# Altium project Integrated Preamp.PrjPcb
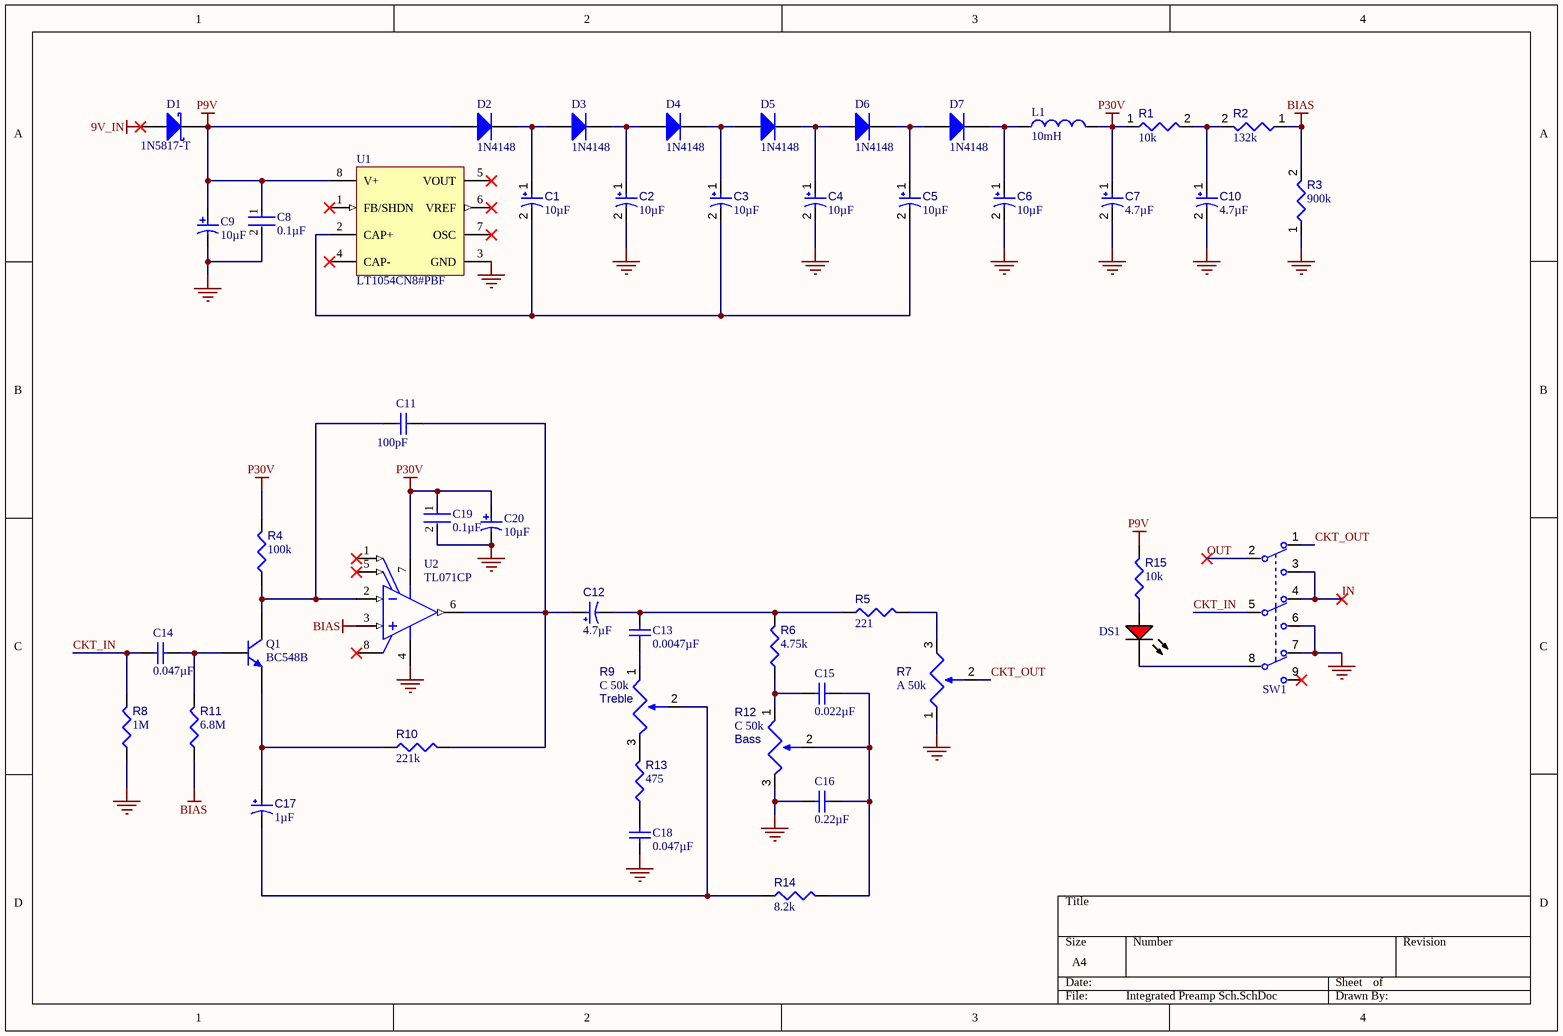
[diagram p0: Integrated Preamp Sch.SchDoc]
1 sheet, 48 parts. Net scope: global (net labels, ports and power ports of the same name join across sheets).
Board files: Integrated Preamp PCB v3.PcbDoc, Integrated Preamp PCB v2.PcbDoc

## Sheet Integrated Preamp Sch.SchDoc
size A4; SheetNumber: 1; SheetTotal: 1

### Parts
C1  value 10µF  [CAPPR55-200-1100X500X1200]  (hidden comment: ECA1HM100)
C2  value 10µF  [CAPPR55-200-1100X500X1200]  (hidden comment: ECA1HM100)
C3  value 10µF  [CAPPR55-200-1100X500X1200]  (hidden comment: ECA1HM100)
C4  value 10µF  [CAPPR55-200-1100X500X1200]  (hidden comment: ECA1HM100)
C5  value 10µF  [CAPPR55-200-1100X500X1200]  (hidden comment: ECA1HM100)
C6  value 10µF  [CAPPR55-200-1100X500X1200]  (hidden comment: ECA1HM100)
C7  value 4.7µF  [CAPPR55-200-1100X500X1200]  (hidden comment: ECA1HM4R7)
C8  0.1µF  [FP-C322C104K5R5TA-MFG]
C9  10µF  [AVX-TAP475K016SCS]
C10  value 4.7µF  [CAPPR55-200-1100X500X1200]  (hidden comment: ECA1HM4R7)
C11  Capacitance: 100pF  [WIMA-MKS2D034701E00]  (hidden comment: MKS2D034701E00KSSD)
C12  value 4.7µF  [CAPPR55-200-1100X500X1200]  (hidden comment: ECA1HM4R7)
C13  Capacitance: 0.0047µF  [WIMA-MKS2D024701A00KSSD]  (hidden comment: CMP-2000-06717-1)
C14  Capacitance: 0.047µF  [WIMA-MKS2D024701A00KSSD]  (hidden comment: .047µF)
C15  Capacitance: 0.022µF  [WIMA-MKS2D024701A00KSSD]  (hidden comment: CMP-2000-06717-1)
C16  Capacitance: 0.22µF  [WIMA-MKS2D024701A00KSSD]  (hidden comment: CMP-2000-06717-1)
C17  value 1µF  [CAPPR55-200-1100X500X1200]  (hidden comment: ECA-1HHG010)
C18  Capacitance: 0.047µF  [WIMA-MKS2D024701A00KSSD]  (hidden comment: CMP-2000-06717-1)
C19  0.1µF  [FP-C322C104K5R5TA-MFG]
C20  10µF  [AVX-TAP475K016SCS]
D1  1N5817-T  [DIOD-DO-41-P-2]
D2  1N4148  [NXP-SOD27-2_V]
D3  1N4148  [NXP-SOD27-2_V]
D4  1N4148  [NXP-SOD27-2_V]
D5  1N4148  [NXP-SOD27-2_V]
D6  1N4148  [NXP-SOD27-2_V]
D7  1N4148  [NXP-SOD27-2_V]
DS1  LTL-1CHE  [INDPR60-254-520X380X650]  (value not drawn)
L1  10mH  [EPCS-B78108S-2_V1]
Q1  BC548B  [ONSC-TO-92-3-29-11]
R1  value 10k  [RESA60-630X240]  (hidden comment: MFR-25FBF52-10K)
R2  value 132k  [RESA60-630X240]  (hidden comment: MFR-25FBF52-100K)
R3  value 900k  [RESA60-630X240]  (hidden comment: MFR-25FBF52-1M)
R4  value 100k  [RESA60-630X240]  (hidden comment: MFR-25FBF52-100K)
R5  value 221  [RESA60-630X240]  (hidden comment: MFR-25FBF52-221R)
R6  value 4.75k  [RESA60-630X240]  (hidden comment: MFR-25FBF52-4K75)
R7  value A 50k  [PCB Mount Potentiometer]  (hidden comment: Potentiometer)
R8  value 1M  [RESA60-630X240]  (hidden comment: MFR-25FBF52-4K75)
R9  Treble  value C 50k  [PCB Mount Potentiometer]
R10  value 221k  [RESA60-630X240]  (hidden comment: MFR-25FBF52-221K)
R11  value 6.8M  [RESA60-630X240]  (hidden comment: MFR-25FBF52-6.8M)
R12  Bass  value C 50k  [PCB Mount Potentiometer]
R13  value 475  [RESA60-630X240]  (hidden comment: MFR-25FBF52-475R)
R14  value 8.2k  [RESA60-630X240]  (hidden comment: MFR-25FBF52-4K75)
R15  value 10k  [RESA60-630X240]  (hidden comment: MFR-25FBF52-10K)
SW1  MPG306F  [3PDT Stomp]  (value not drawn)  (mechanical)
U1  LT1054CN8#PBF  [LT-N8-8]
U2  TL071CP  [P0008A]

### Nets
9V_IN: D1.1(A)
BIAS: R2.1 R3.2 R11.1 U2.3(IN+)
GND: C2.2 C4.2 C6.2 C7.2 C8.2 C9.2 C10.2 C16.1 C18.1 C19.2 C20.2 R3.1 R7.1 R8.1 R12.3 SW1.6 SW1.7 U1.3(GND) U2.4(VCC-)
P9V: C8.1 C9.1 D1.2(K) D2.1(A) R15.2 U1.8(V+)
P30V: C7.1 C19.1 C20.1 L1.2 R1.1 R4.2 U2.7(VCC+)
CKT_IN: C14.1 R8.2 SW1.5
CKT_OUT: R7.2 SW1.1
IN: SW1.3 SW1.4
OUT: SW1.2
NetC1_1: C1.1 D2.2(K) D3.1(A)
NetC1_2: C1.2 C3.2 C5.2 U1.2(CAP+)
NetC2_1: C2.1 D3.2(K) D4.1(A)
NetC3_1: C3.1 D4.2(K) D5.1(A)
NetC4_1: C4.1 D5.2(K) D6.1(A)
NetC5_1: C5.1 D6.2(K) D7.1(A)
NetC6_1: C6.1 D7.2(K) L1.1
NetC10_1: C10.1 R1.2 R2.2
NetC11_1: C11.1 Q1.1(C) R4.1 U2.2(IN-)
NetC11_2: C11.2 C12.1 R10.2 U2.6(OUT)
NetC12_2: C12.2 C13.2 R5.1 R6.2
NetC13_1: C13.1 R9.1
NetC14_2: C14.2 Q1.2(B) R11.2
NetC15_1: C15.1 R6.1 R12.1
NetC15_2: C15.2 C16.2 R12.2 R14.2
NetC17_1: C17.1 Q1.3(E) R10.1
NetC17_2: C17.2 R9.2 R14.1
NetC18_2: C18.2 R13.1
NetDS1_1: DS1.1(A) R15.1
NetDS1_2: DS1.2(K) SW1.8
NetR5_2: R5.2 R7.3
NetR9_3: R9.3 R13.2

Not connected (* = marked no-connect by the designer): SW1 9*; U1 1(FB/SHDN)* 4(CAP-)* 5(VOUT)* 6(VREF)* 7(OSC)*; U2 1(OFFSET_N1)* 5(OFFSET_N2)* 8(NC)*

### Library data of the parts
C1-C6 = CMP-001-00025-7: Aluminum Electrolytic Capacitor, 10 uF, +/- 20%, 50 V, -40 to 85 degC, 2-Pin THD, RoHS, Bulk; Manufacturer: Panasonic; Ripple Current (AC): 65mA; Voltage Rating: 50V; Mounting Technology: TH; RoHS Compliant: True; Capacitor Type: Electrolytic; Datasheet Version: Rev. 05, 10/2016; Min Operating Temperature: -40°C; Packaging: Bulk; Ripple Current: 65mA; Tolerance: 20%; Max Operating Temperature: 85°C; Datasheet URL: https://industrial.panasonic.com/cdbs/www-data/pdf/RDF0000/ABA0000C1218.pdf; Lead Pitch: 2mm; Pins: 2; Diameter: 5mm; Manufacturer URL: http://www.panasonic.com/; Package Reference: CAPPR55-200-1100X500X1200; Package Description: 2-Pin Radial Lead, Dia 5 mm, Height 12 mm; Case/Package: Radial; Package Quantity: 200
C7 C10 C12 = CMP-001-00033-7: Aluminum Electrolytic Capacitor, 4.7 uF, +/- 20%, 50 V, -40 to 85 degC, 2-Pin THD, RoHS, Bulk; Manufacturer: Panasonic; Ripple Current (AC): 45mA; Voltage Rating: 50V; Diameter: 5mm; Min Operating Temperature: -40°C; Lead Pitch: 2mm; Package Quantity: 200; Capacitor Type: Electrolytic; Ripple Current: 45mA; Datasheet Version: Rev. 05, 10/2016; Case/Package: Radial; Pins: 2; Manufacturer URL: http://www.panasonic.com/; RoHS Compliant: True; Package Description: 2-Pin Radial Lead, Dia 5 mm, Height 12 mm; Packaging: Bulk; Datasheet URL: https://industrial.panasonic.com/cdbs/www-data/pdf/RDF0000/ABA0000C1218.pdf; Mounting Technology: TH; Max Operating Temperature: 85°C; Package Reference: CAPPR55-200-1100X500X1200; Tolerance: 20%
C8 C19 = CMP-03020-034661-1: CAP CER 0.1UF 50V X7R RADIAL; Capacitance: 100nF; Dielectric Material: Ceramic; Dissipation Factor: 2.5%; Lead Length: 7mm; Tolerance: 10%; Lead Diameter: 0.51mm; Lead/Base Style: Formed Leads; Construction: RADIAL; RoHS Compliant: Yes; Voltage Rating (DC): 50V; Packaging: Bulk; Lead Free: Lead Free; Width: 0.125inch; Lead Pitch: 5.08mm; Voltage Rating: 50V; Number of Pins: 2; Radiation Hardening: No; Material: Ceramic; REACH SVHC: No SVHC; Height - Seated (Max): 0.26inch; Case/Package: Radial; Weight: 0.0625lb; Dielectric: X7R; Min Operating Temperature: -55°C; Voltage: 50V; Series: Golden Max™; Max Operating Temperature: 125°C; Height: 3.18mm; Termination: Radial; Length: 5.08mm; Depth: 3.18mm; Package Quantity: 500; Mount: Through Hole
C9 C20 = CMP-2000-07562-1: Dipped Radial Capacitor, 4.7 uF, +/- 10%, 16 V, -55 to 125 degC, RoHS, Bulk; Manufacturer: AVX; Life (Hours): 1000Hour; Dissipation Factor: 6%; Voltage: 16V; Polarity: Polar; ESR (Equivalent Series Resistance): 5Ohm; Lead Diameter: 0.5mm; Dielectric Material: Tantalum; Capacitance: 4.7uF; Leakage Current: 600nA; Mounting Technology: ThroughHole; Tolerance: 10%; Number of Pins: 2; REACH SVHC: NoSVHC; RoHSCompliant: True; Min Operating Temperature: -55degC; Packaging: Bulk; Termination: Radial; Case\/Package: Dipped; Lead Free: LeadFree; Voltage Rating: 16V; Radiation Hardening: No; Package Quantity: 1000; Voltage Rating (DC): 16V; Height - Seated (Max): 0.295inch; Mount: PCB; Max Operating Temperature: 125degC; Datasheet URL: http://datasheets.avx.com/tap.pdf; Datasheet Version: 08/2015; Manufacturer URL: http://www.avx.com/; Package Reference: TAP475K016SCS; Lead Pitch: 2.5mm; Length: 7.5mm; Package Description: 2-Pin Through Hole Device, Dia 4.5 mm, Height 7.5 mm; Height: 7.5mm; Diameter: 4.5mm
C11 C13-C16 C18 = CMP-2000-06717-1: Metallized Polyester (PET) Capacitor, 0.47 uF, +/- 10%, 100 V DC, 63 V AC, -55 to 100 degC, 2-Pin THD, RoHS, Bulk; Manufacturer: Wima; SVHC: NoSVHC(15-Jun-2015); Capacitor Dielectric Type: PET(Polyester); Voltage Rating: 100V; Capacitor Terminals: RadialLeaded; Product Range: MKS2Series; Package Description: 2-Pin Through Hole Device, Body 7.2 x 4.5 mm, Pitch 5 mm; Mounting Technology: ThroughHole; Package Reference: MKS2D034701E00; Packaging: Each; Automotive Qualification Standard: -; Datasheet Version: 04/2016; Manufacturer URL: http://www.wima.com/; Operating Temperature Max: 100°C; Datasheet URL: http://www.wima.com/EN/WIMA_MKS_2.pdf; Operating Temperature Min: -55°C; Capacitance Tolerance: ±10%; Lead Spacing: 5mm; Capacitor Case Style: -
C17 = CMP-001-00024-7: Aluminum Electrolytic Capacitor, 1 uF, +/- 20%, 50 V, -55 to 105 degC, 2-Pin THD, RoHS, Bulk; Manufacturer: Panasonic; Voltage Rating: 50V; Ripple Current: 10mA; Packaging: Bulk; Package Quantity: 200; Tolerance: 20%; Min Operating Temperature: -55°C; Diameter: 5mm; Capacitor Type: Electrolytic; Datasheet Version: Mar-05; Ripple Current (AC): 10mA; Manufacturer URL: http://www.panasonic.com/; Case/Package: Radial; Mounting Technology: TH; Pins: 2; Package Reference: CAPPR55-200-1100X500X1200; Package Description: 2-Pin Radial Lead, Dia 5 mm, Height 12 mm; RoHS Compliant: True; Max Operating Temperature: 105°C; Lead Pitch: 2mm; Datasheet URL: https://datasheet.ciiva.com/7275/94060-7275472.pdf
D1 = CMP-2000-05521-1: Schottky Barrier Rectifier, 1 A, 20 V, -65 to 125 degC, 2-Pin DO-41, RoHS, Tape and Reel; Manufacturer: DiodesIncorporated; Vrrm - Repetitive Reverse Voltage: 20V; If - Forward Current: 1A; Configuration: Single; Unit Weight: 0.010582oz; Type: SchottkyDiode; Ifsm - Forward Surge Current: 25A; Vf - Forward Voltage: 0.75Vat3A; Ir - Reverse Current: 1000uA; Technology: Si; Length: 5.21mm; Product: SchottkyRectifiers; Package Reference: DO-41-P-2; Package / Case: DO-41; Datasheet URL: http://www.diodes.com/_files/datasheets/ds23001.pdf; Operating Temperature Range: -65Cto+125C; Mounting Style: ThroughHole; Manufacturer URL: http://www.diodes.com/; Series: 1N58; Minimum Operating Temperature: -65C; Height: 2.72mm; Brand: DiodesIncorporated; Maximum Operating Temperature: +125C; Datasheet Version: Rev. 8-2, 05/2009; Factory Pack Quantity: 5000; Width: 2.72mm; RoHS: True; Product Category: SchottkyDiodes&Rectifiers; Package Description: 2-Pin Through Hole Device, Body 4.635 x 2.36 mm, Pin Spacing 7.85 mm; Packaging: Reel; Termination Style: ThroughHole; Mounting Technology: ThroughHole
D2-D7 = CMP-004-00000-2: High Speed Diode, 100 V, 0.45 A, -65 to 175 degC, 2-Pin SOD27, RoHS, Bulk; Manufacturer: Fairchild; Elements: 1; Recovery Time: 4ns; Forward Current: 300mA; Power: 500mW; Forward Voltage: 1V; Max Surge Current: 4A; Peak Reverse Current: 5uA; Datasheet URL: http://www.nxp.com/documents/data_sheet/1N4148_1N4448.pdf; Min Operating Temperature: -65°C; Manufacturer URL: https://www.fairchildsemi.com/; Packaging: Bulk; Diameter: 1.91mm; Pins: 2; Package URL: http://www.nxp.com/documents/data_sheet/1N4148_1N4448.pdf; Package Reference: SOD27; Max Operating Temperature: 175°C; Package Quantity: 2000; Case/Package: DO; Datasheet Version: Aug-04; RoHS Compliant: True
DS1 = CMP-007-00018-2: LED Uni-Color Red, 100 mW, 30 mA, -55 to 100 degC, 2-Pin THD, RoHS, Bulk; Manufacturer: Lite-On; Forward Current: 20mA; Nominal Vf: 2V; Viewing Angle: 60degrees; Luminous Intensity: 12.6mcd; Lens Style: Dome; Pins: 2; RoHS Compliant: True; Package Reference: LTL-1CHE; Package Quantity: 1000; Mounting Technology: TH; Min Operating Temperature: -55°C; Colour: Red; Case/Package: Radial; Manufacturer URL: http://www.us.liteon.com/; Datasheet URL: https://datasheet.ciiva.com/15117/getdatasheetpartid-187746-15117985.pdf; Forward Voltage: 2V; Max Operating Temperature: 100°C; Illumination Colour: Red; Package Description: 2-Pin Through Hole Device, Dia 3.8 mm, Pitch 2.54 mm; Packaging: Bulk; Datasheet Version: Dec-03
L1 = CMP-0816-00001-1: RF Choke, 470 uH +/- 5%, 170 mA, Dia 4 mm, Length 9.2 mm, Axial Leads, RoHS, Tape and Reel; Manufacturer: EPCOS; PartNumber: B78108S1474J; IR: 170 mA; Q: 70 Min.; R: 7.9 Ohm Max.; Fres: 2.2 MHz Min.; Tolerance: +/- 5%; LR: 470 uH; FQ: 0.796 MHz; ComponentLink2Description: Datasheet; RoHS: TRUE; PackageReference: B78108S-2; ComponentLink2URL: http://www.epcos.com/inf/30/db/ind_2008/b78108_148s.pdf; DatasheetVersion: Jun-12; Mounting Technology: Through Hole; PackageDescription: 2-Pin RF Choke, Dia 4 mm, Length 9.2 mm; ComponentLink1Description: Manufacturer URL; ComponentLink1URL: http://www.epcos.com/; Packing: Tape and Reel
Q1 = CMP-1048-01456-1: Amplifier Transistor, NPN Silicon, 3-Pin TO-92, Bulk Box; Manufacturer: On Semiconductor; IC Continuous (A): 0.1; fT Min (MHz): 150; Mounting Technology: Through Hole; ComponentLink3Description: Package Specification; Polarity: NPN; ComponentLink3URL: http://www.onsemi.cn/pub_link/Collateral/2N6426-D.PDF; PartNumber: BC548B; ComponentLink2Description: Datasheet; ComponentLink1Description: Manufacturer URL; ComponentLink2URL: http://www.onsemi.com/pub_link/Collateral/BC546-D.PDF; PackageReference: TO-92-3-29-11_AM_SL; DatasheetVersion: Rev. 7; PackageDescription: 3-Pin Transistor Outline, Body 4.825 x 3.685 mm, Pitch 1.27 mm; PackageVersion: Rev. AM; Packing: Bulk Box; RoHS: FALSE; ComponentLink1URL: http://www.onsemi.com/
R1 R15 = CMP-009-00047-4: Axial Resistor, 10 KOhm, +/- 1%, 0.25 W, -55 to 155 degC, 2-Pin THD, RoHS, Bulk; Manufacturer: Yageo; Power: 250mW; Voltage Rating: 250V; Manufacturer URL: http://www.yageo.com/; Datasheet URL: http://www.yageo.com/documents/recent/Yageo%20LR_MFR_2013.pdf; Package Reference: MFR-25; Min Operating Temperature: -55°C; Mounting Technology: TH; Package Quantity: 200; Case/Package: Axial; Tolerance: 1%; RoHS Compliant: True; Datasheet Version: Apr-13; Packaging: Bulk; Max Operating Temperature: 155°C; Package Description: 2-Pin Axial Lead, Dia 2.4 mm, Body Length 6.3 mm
R2 R4 = CMP-009-00045-4: Axial Resistor, 100 KOhm, +/- 1%, 0.25 W, -55 to 155 degC, 2-Pin THD, RoHS, Bulk; Manufacturer: Yageo; Power: 250mW; Voltage Rating: 250V; Case/Package: Axial; Max Operating Temperature: 155°C; Package Reference: MFR-25; Package Quantity: 200; Package Description: 2-Pin Axial Lead, Dia 2.4 mm, Body Length 6.3 mm; Tolerance: 1%; Manufacturer URL: http://www.yageo.com/; Packaging: Bulk; Mounting Technology: TH; Min Operating Temperature: -55°C; RoHS Compliant: True; Datasheet Version: Apr-13; Datasheet URL: http://www.yageo.com/documents/recent/Yageo%20LR_MFR_2013.pdf
R3 = CMP-009-00049-5: Axial Resistor, 1 MOhm, +/- 1%, 250 mW, -55 to 155 degC, 2-Pin THD, RoHS, Bulk; Manufacturer: Yageo; Voltage Rating: 250V; Power: 250mW; Package Reference: MFR-25; Tolerance: 1%; Manufacturer URL: http://www.yageo.com/; Case/Package: Axial; Datasheet URL: http://www.yageo.com/documents/recent/Yageo%20LR_MFR_2013.pdf; Datasheet Version: Apr-13; Package Quantity: 200; Mounting Technology: TH; Min Operating Temperature: -55°C; Packaging: Bulk; Package Description: 2-Pin Axial Lead, Dia 2.4 mm, Body Length 6.3 mm; RoHS Compliant: True; Max Operating Temperature: 155°C
R5 = CMP-009-00051-4: Axial Resistor, 221 Ohm, +/- 1%, 250 mW, -55 to 155 degC, 2-Pin THD, RoHS, Bulk; Manufacturer: Yageo; Power: 250mW; Voltage Rating: 250V; Package Quantity: 200; Manufacturer URL: http://www.yageo.com/; Case/Package: Axial; Package Reference: MFR-25; RoHS Compliant: True; Mounting Technology: TH; Datasheet URL: http://www.yageo.com/documents/recent/Yageo%20LR_MFR_2013.pdf; Packaging: Bulk; Package Description: 2-Pin Axial Lead, Dia 2.4 mm, Body Length 6.3 mm; Max Operating Temperature: 155°C; Tolerance: 1%; Datasheet Version: Apr-13; Min Operating Temperature: -55°C
R6 R8 R14 = CMP-009-00059-4: Axial Resistor, 4.75 KOhm, +/- 1%, 0.25 W, -55 to 155 degC, 2-Pin THD, RoHS, Bulk; Manufacturer: Yageo; Voltage Rating: 250V; Power: 250mW; Datasheet Version: Apr-13; Mounting Technology: TH; Package Reference: MFR-25; RoHS Compliant: True; Composition: MetalFilm; Datasheet URL: http://www.yageo.com/documents/recent/Yageo%20LR_MFR_2013.pdf; Max Operating Temperature: 155°C; Package Quantity: 200; Case/Package: Axial; Package Description: 2-Pin Axial Lead, Dia 2.4 mm, Body Length 6.3 mm; Tolerance: 1%; Packaging: Bulk; Manufacturer URL: http://www.yageo.com/; Min Operating Temperature: -55°C
R9 R12 = Potentiometer
R10 = CMP-009-00050-4: Axial Resistor, 221 KOhm, +/- 1%, 0.25 W, -55 to 155 degC, 2-Pin THD, RoHS, Bulk; Manufacturer: Yageo; Power: 250mW; Voltage Rating: 250V; Package Reference: MFR-25; Package Quantity: 200; Packaging: Bulk; Package Description: 2-Pin Axial Lead, Dia 2.4 mm, Body Length 6.3 mm; Datasheet Version: Apr-13; Max Operating Temperature: 155°C; Min Operating Temperature: -55°C; Datasheet URL: http://www.yageo.com/documents/recent/Yageo%20LR_MFR_2013.pdf; Case/Package: Axial; Manufacturer URL: http://www.yageo.com/; Tolerance: 1%; RoHS Compliant: True; Mounting Technology: TH
R11 = CMP-009-00049-5: Axial Resistor, 6.8 MOhm, +/- 1%, 250 mW, -55 to 155 degC, 2-Pin THD, RoHS, Bulk; Manufacturer: Yageo; Voltage Rating: 250V; Power: 250mW; Package Reference: MFR-25; Tolerance: 1%; Manufacturer URL: http://www.yageo.com/; Case/Package: Axial; Datasheet URL: http://www.yageo.com/documents/recent/Yageo%20LR_MFR_2013.pdf; Datasheet Version: Apr-13; Package Quantity: 200; Mounting Technology: TH; Min Operating Temperature: -55°C; Packaging: Bulk; Package Description: 2-Pin Axial Lead, Dia 2.4 mm, Body Length 6.3 mm; RoHS Compliant: True; Max Operating Temperature: 155°C
R13 = CMP-009-00056-4: Axial Resistor, 475 Ohm, +/- 1%, 0.25 W, -55 to 155 degC, 2-Pin THD, RoHS, Bulk; Manufacturer: Yageo; Voltage Rating: 250V; Power: 250mW; Case/Package: Axial; Datasheet URL: http://www.yageo.com/documents/recent/Yageo%20LR_MFR_2013.pdf; Tolerance: 1%; RoHS Compliant: True; Mounting Technology: TH; Packaging: Bulk; Package Description: 2-Pin Axial Lead, Dia 2.4 mm, Body Length 6.3 mm; Max Operating Temperature: 155°C; Package Reference: MFR-25; Datasheet Version: Apr-13; Min Operating Temperature: -55°C; Package Quantity: 200; Manufacturer URL: http://www.yageo.com/
SW1 = CMP-03402-000028-1: SWITCH PUSHBUTTON 3PDT 6A 125V; Voltage Rating (AC): 250V; Contact Resistance: 10mR; Current Rating: 4A; Switch Function: On-Mom; Illumination Type: Illuminated; Actuator Length: 0.315inch; Actuator Type: Round, Button; Actuator Material: Resin; Voltage Rating (DC): 28V; Electrical Life: 50000Cycles; Max Voltage Rating (AC): 250V; Lead Free: Contains Lead; Series: MPG; Min Operating Temperature: -20°C; Orientation: Straight; Length: 17.8mm; RoHS Compliant: Yes; Type: Switch; REACH SVHC: No SVHC; Throw Configuration: 3PDT; Mount: Panel; Contact Current Rating: 6A; Termination: Lug; Contact Plating: Gold; Max Operating Temperature: 80°C; ELV: Compliant; Packaging: Bulk; Contact Material: Copper; Housing Material: Thermoset
U1 = CMP-0475-00280-1: Switched-Capacitor Voltage Converter with Regulator, 3.5 to 15 V Vin, Adjustable Vout, 8-pin DIP (N8-8), 0 to 100 degC, Pb-Free; Manufacturer: Linear Technology; Voutput: Adj; Vin Max(V): 15; Isupply(mA): 2.5; Vin Min(V): 3.5; Frequency(kHz): 25; Ishutdown(uA): 100; PackageDescription: 8-Pin PDIP, Body 10.16 x 6.48 mm, Pitch 2.54 mm; DatasheetVersion: Rev. G; RoHS: TRUE; PackageReference: N8-8; ComponentLink1URL: http://www.linear.com/; PartNumber: LT1054CN8#PBF; ComponentLink2URL: http://cds.linear.com/docs/en/datasheet/1054lfg.pdf; PackageVersion: Rev. I, 07/2011; ComponentLink3URL: http://www.linear.com/docs/en/packaging/05081510_I_N8.pdf; Mounting Technology: Through Hole; Max Iout(mA): 100; ComponentLink3Description: Package Specification; ComponentLink2Description: Datasheet; ComponentLink1Description: Manufacturer URL
U2 = CMP-0017-00972-2: Low-Noise JFET-Input General-Purpose Operational Amplifier, 7 to 36 V, 0 to 70 degC, 8-pin DIP (P8), Pb-Free (RoHS); Manufacturer: Texas Instruments; Total Supply Voltage(Min)(+5V is 5, +/-5V is 10): 7; Iq per channel(Max)(mA): 2.5; GBW(Typ)(MHz): 3; Vio (25C)(Max)(mV): 10; CMRR(Min)(dB): 70; Rating: Military; Vn at 1kHz(Typ)(nV/rtHz): 18; IIB(Max)(pA): 200; Number of Channels: 1; Sub Family: General Purpose Amplifier, High Supply Voltage Amplifier (>=30V); Total Supply Voltage(Max)(+5V is 5, +/-5V is 10): 36; Slew Rate(Typ)(V/us): 13; ComponentLink1Description: Manufacturer URL; PackageReference: P0008A; ComponentLink3Description: Package Specification; ComponentLink3URL: http://www.ti.com/litv/pdf/mpdi001b; Mounting Technology: Through Hole; ComponentLink2Description: Datasheet; ComponentLink2URL: http://www.ti.com/lit/ds/symlink/tl071.pdf; PartNumber: TL071CP; Eco-Plan: Pb-Free (RoHS); Offset Drift(Typ)(uV/C): 18; Code_JEDEC: MS-001; DatasheetVersion: SLOS080J; PackageVersion: 4040082/E, 04/2010; PackageDescription: 8-Pin Plastic In-Line, Body 9.59 x 6.35 mm, Pitch 2.54 mm; ComponentLink1URL: http://www.ti.com/